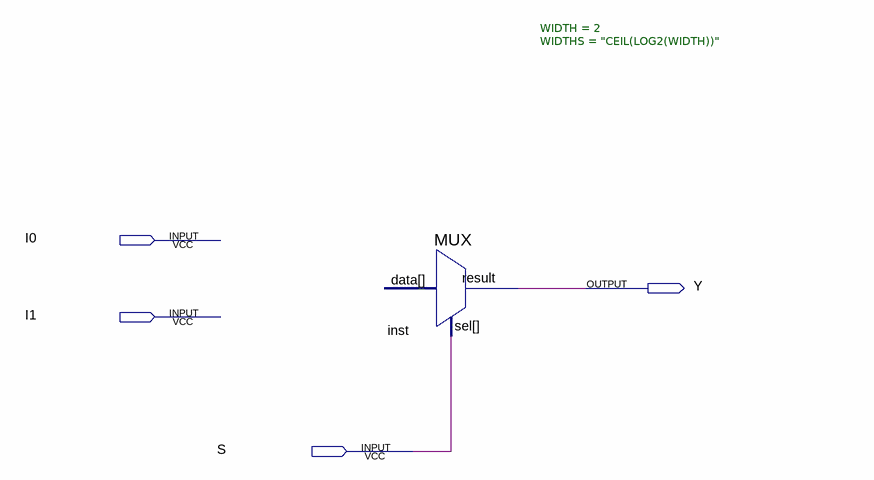
[diagram p0: schematic sheet]
// Quartus schematic MuxDemo.bdf as structural Verilog: 1 symbols, 4 pins
module MuxDemo (
  input  I0,
  input  I1,
  input  S,
  output Y
);

  MUX #(.WIDTH(2), .WIDTHS("CEIL(LOG2(WIDTH))")) inst (.sel(S), .result(Y));  // open: data
endmodule
